# Altium schematic sheet Sheet1.SchDoc
size A4
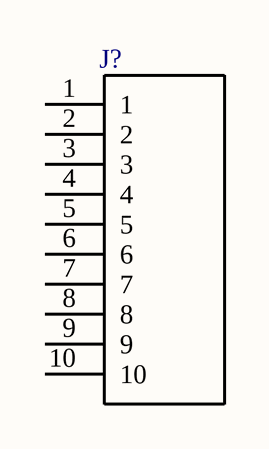
[diagram p0: Sheet1.SchDoc]

## Parts
J?  5499913-1  [*TE_5499913-1]  (value not drawn)

## Nets

Not connected (* = marked no-connect by the designer): J? 1 2 3 4 5 6 7 8 9 10

## Library data of the parts
J? = 5499913-1: HEADER; UNIVERSAL EJECTION PIN; AMP-LATCH; 10 POS; 2.54 X 2.54; PCB; RIGHT ANGLE; Centerline_Pitch: 2.54 mm[.1 in]; MF: TE Connectivity; Number_of_Positions: 10; Product_Type: Connector; Price: None; SnapEDA_Link: https://www.snapeda.com/parts/5499913-1/TE%20Connectivity%20AMP%20Connectors/view-part/52128/?ref=snap; EU_RoHS_Compliance: Compliant; MP: 5499913-1; TE_purchase_URL: https://www.te.com/usa-en/product-5499913-1.html?te_bu=Cor&te_type=disp&te_campaign=seda_glo_cor-seda-global-disp-prtnr-fy19-seda-model-bom-cta_sma-317_1&elqCampaignId=32493; Availability: Unavailable; Package: None; Value: *